# EAGLE schematic AudioBoard (EAGLE 9.3.2)
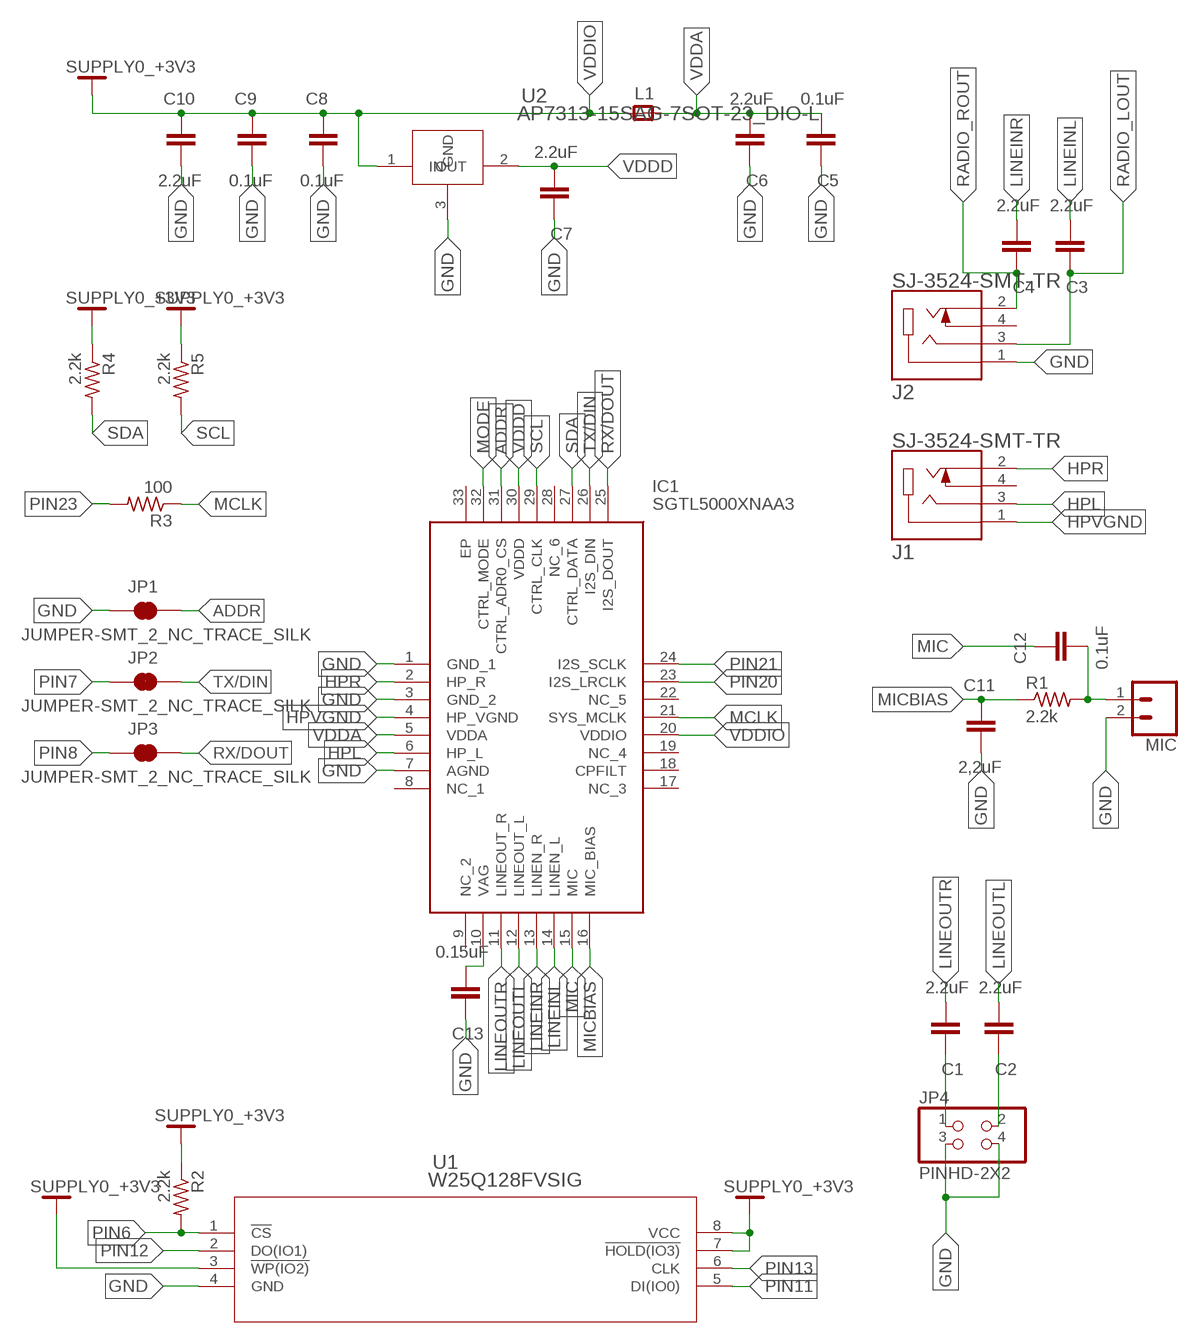
[diagram p0: schematic, sheet 1]

## Parts
C1  2.2uF  CC0805KRX7R9BB104  [CAP_0805]
C2  2.2uF  CC0805KRX7R9BB104  [CAP_0805]
C3  2.2uF  CC0805KRX7R9BB104  [CAP_0805]
C4  2.2uF  CC0805KRX7R9BB104  [CAP_0805]
C5  0.1uF  CC0805KRX7R9BB104  [CAP_0805]
C6  2.2uF  CC0805KRX7R9BB104  [CAP_0805]
C7  2.2uF  CC0805KRX7R9BB104  [CAP_0805]
C8  0.1uF  CC0805KRX7R9BB104  [CAP_0805]
C9  0.1uF  CC0805KRX7R9BB104  [CAP_0805]
C10  2.2uF  CC0805KRX7R9BB104  [CAP_0805]
C11  2,2uF  CC0805KRX7R9BB104  [CAP_0805]
C12  0.1uF  CC0805KRX7R9BB104  [CAP_0805]
C13  0.15uF  CC0805KRX7R9BB104  [CAP_0805]
IC1  SGTL5000XNAA3  [QFN50P500X500X90-33N]
J1  SJ-3524-SMT-TR  [SJ-3524-SMT-TR]
J2  SJ-3524-SMT-TR  [SJ-3524-SMT-TR]
JP1  JUMPER-SMT_2_NC_TRACE_SILK  [SMT-JUMPER_2_NC_TRACE_SILK]
JP2  JUMPER-SMT_2_NC_TRACE_SILK  [SMT-JUMPER_2_NC_TRACE_SILK]
JP3  JUMPER-SMT_2_NC_TRACE_SILK  [SMT-JUMPER_2_NC_TRACE_SILK]
JP4  PINHD-2X2  [2X02]
L1  RC-MASTER-SMD_FB_0805MP  [RC-MASTER-SMD_L0805MP]
MIC  CONN_02  [1X02]
R1  2.2k  R-US_R0805  [R0805]
R2  2.2k  R-US_R0805  [R0805]
R3  100  R-US_R0805  [R0805]
R4  2.2k  R-US_R0805  [R0805]
R5  2.2k  R-US_R0805  [R0805]
U1  W25Q128FVSIG  [WIN_S-8_WIN]
U2  AP7313-15SAG-7SOT-23_DIO-L  [SOT-23_DIO-L]

## Nets
+3V3: R2.1 R4.1 R5.1 U1.3(!WP(IO2)) U1.7(!HOLD(IO3)) U1.8(VCC) ; supply symbol labelled SUPPLY0_+3V3
ADDR: IC1.31(CTRL_ADR0_CS) JP1.2
GND: C5.1 C6.1 C7.1 C8.2 C9.2 C10.2 C11.2 C13.1 IC1.1(GND_1) IC1.3(GND_2) IC1.7(AGND) J2.1 JP1.1 JP4.3 JP4.4 MIC.2 U1.4(GND) U2.3(GND)
HPL: IC1.6(HP_L) J1.3
HPR: IC1.2(HP_R) J1.2
HPVGND: IC1.4(HP_VGND) J1.1
LINEINL: C3.2 IC1.14(LINEN_L)
LINEINR: C4.2 IC1.13(LINEN_R)
LINEOUTL: C2.2 IC1.12(LINEOUT_L)
LINEOUTR: C1.2 IC1.11(LINEOUT_R)
MCLK: IC1.21(SYS_MCLK) R3.1
MIC: C12.1 IC1.15(MIC)
MICBIAS: C11.1 IC1.16(MIC_BIAS) R1.1
MODE: IC1.32(CTRL_MODE)
N$3: C13.2 IC1.10(VAG)
N$4: C1.1 JP4.1
N$5: C12.2 MIC.1 R1.2
N$6: C2.1 JP4.2
PIN6: R2.2 U1.1(!CS)
PIN7: JP2.1
PIN8: JP3.1
PIN11: U1.5(DI(IO0))
PIN12: U1.2(DO(IO1))
PIN13: U1.6(CLK)
PIN20: IC1.23(I2S_LRCLK)
PIN21: IC1.24(I2S_SCLK)
PIN23: R3.2
RADIO_LOUT: C3.1 J2.3
RADIO_ROUT: C4.1 J2.2
RX/DOUT: IC1.25(I2S_DOUT) JP3.2
SCL: IC1.29(CTRL_CLK) R5.2
SDA: IC1.27(CTRL_DATA) R4.2
TX/DIN: IC1.26(I2S_DIN) JP2.2
VDDA: C5.2 C6.2 IC1.5(VDDA) L1.2
VDDD: C7.2 IC1.30(VDDD) U2.2(OUT)
VDDIO: C8.1 C9.1 C10.1 IC1.20(VDDIO) L1.1 U2.1(IN) ; supply symbol labelled SUPPLY0_+3V3
Unconnected: IC1.8(NC_1) IC1.9(NC_2) IC1.17(NC_3) IC1.18(CPFILT) IC1.19(NC_4) IC1.22(NC_5) IC1.28(NC_6) IC1.33(EP) J1.4 J2.4

## Library data of the parts
C1-C13 = Resistor_Capacitor:CC0805KRX7R9BB104: CAP CER 0.1UF 50V X7R 0805 Manufacturer's datasheet <http://www.yageo.com/documents/recent/UPY-GPHC_X7R_6.3V-to-50V_18.pdf>; CREATED_BY: PCBLayout.com; DIGIKEY_PART_NUMBER: 311-1140-2-ND; MANUFACTURER: Yageo; MPN: CC0805KRX7R9BB104; PACKAGE: SMD 0805
IC1 = SamacSys_Parts:SGTL5000XNAA3: NXP, Audio Codec Stereo Audio 2-channel 24bit- 96kHz Serial-I2C, Serial-SPI 32-Pin QFN Source: Datasheet <http://www.nxp.com/docs/en/data-sheet/SGTL5000.pdf>; DESCRIPTION: NXP, Audio Codec Stereo Audio 2-channel 24bit- 96kHz Serial-I2C, Serial-SPI 32-Pin QFN; HEIGHT: 0.9mm; MANUFACTURER_NAME: NXP; MANUFACTURER_PART_NUMBER: SGTL5000XNAA3; MOUSER_PART_NUMBER: 841-SGTL5000XNAA3; MOUSER_PRICE-STOCK: https://www.mouser.co.uk/ProductDetail/NXP-Semiconductors/SGTL5000XNAA3?qs=g5o6z0NmdpQ52bnp6yi7dA%3D%3D
J1 J2 = Audio Connectors:SJ-3524-SMT-TR: CONN JACK STEREO 3.5MM SMD R/A Manufacturer's datasheet <https://www.cuidevices.com/product/resource/sj-352x-smt.pdf>; CREATED_BY: PCBLayout.com; DIGIKEY_PARTNO: CP-3524SJTR-ND; MANUFCATURER: CUI Devices; MPN: SJ-3524-SMT-TR
JP1-JP3 = SparkFun-Jumpers:JUMPER-SMT_2_NC_TRACE: Normally closed trace jumper This jumper has a trace between two pads so it's normally closed (NC). Use a razor knife to open the connection. For best results follow the IPC guidelines for cutting traces: Cutout at least 0.063 mm (0.005 in). Remove all loose material to clean up the cut area. Seal the cut with an approved epoxy. Reapply solder to reclose the connection.
JP4 = Connector:PINHD-2X2: PIN HEADER; CATEGORY: CONNECTOR; SUB-CATEGORY: PIN-HEADER
L1 = 52101-101-REV-A:RC-MASTER-SMD_FB_: FERRITE BEAD
MIC = SparkFun-Connectors:CONN_02: Multi connection point. Often used as Generic Header-pin footprint for 0.1 inch spaced/style header connections On any of the 0.1 inch spaced packages, you can populate with these: Break Away Headers - Straight <https://www.sparkfun.com/products/116> (PRT-00116) Break Away Male Headers - Right Angle <https://www.sparkfun.com/products/553> (PRT-00553) Female Headers <https://www.sparkfun.com/products/115> (PRT-00115) Break Away Headers - Machine Pin <https://www.sparkfun.com/products/117> (PRT-00117) Break Away Female Headers - Swiss Machine Pin <https://www.sparkfun.com/products/743> (PRT-00743) For SCREWTERMINALS and SPRING TERMINALS visit here: Screw Terimnals on SparkFun.com <https://www.sparkfun.com/search/results?term=Screw+Terminals> (5mm/3.5mm/2.54mm spacing) This device is also useful as a general connection point to wire up your design to another part of your project. Our various solder wires solder well into these plated through hole pads. Hook-Up Wire - Assortment (Stranded, 22 AWG) <https://www.sparkfun.com/products/11375> (PRT-11375) Hook-Up Wire - Assortment (Solid Core, 22 AWG) <https://www.sparkfun.com/products/11367> (PRT-11367) View the entire wire category on our website here <https://www.sparkfun.com/categories/141> Special notes: Molex polarized connector foot print use with: PRT-08233 with associated crimp pins and housings. 2.54_SCREWTERM for use with PRT-10571. 3.5mm Screw Terminal footprints for PRT-08084 5mm Screw Terminal footprints for use with PRT-08432
R1-R5 = BeagleBone_Black_Wireless:R-US_: RESISTOR, American symbol
U1 = SPIFlash:W25Q128FVSIG; BUILT_BY: EMA_UL_Team; COPYRIGHT: Copyright (C) 2018 Accelerated Designs. All rights reserved; MANUFACTURER_PART_NUMBER: W25Q128FVSIG; SOURCELIBRARY: Winbond_2018-12-15; VENDOR: Winbond
U2 = AP7313:AP7313-15SAG-7; BUILT_BY: EMA_UL_Team; MANUFACTURER_PART_NUMBER: AP7313-15SAG-7; SOURCELIBRARY: DIODESINC_2_2015-08-18; VENDOR: Diodes Inc